# EasyEDA Pro project ProPrj_tachoConverter_2025-10-29.epro

# Schematic untitled
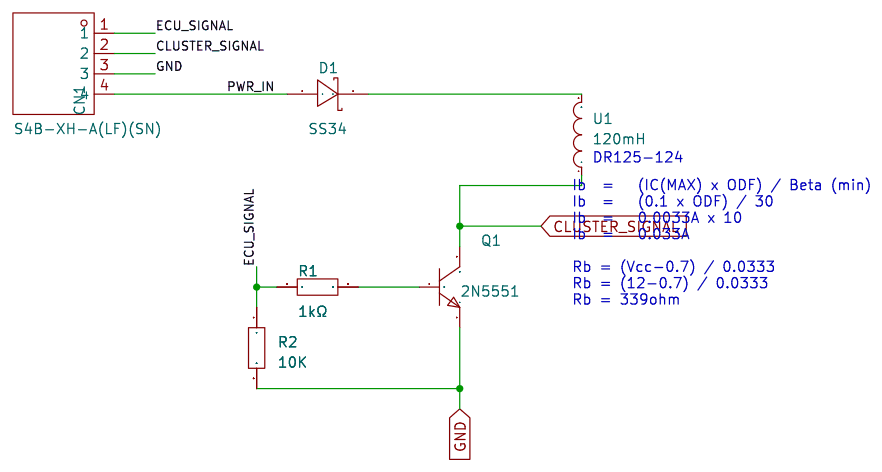
[diagram p0: schematic sheet]

## Parts
CN1  S4B-XH-A(LF)(SN)  [CONN-TH_S4B-XH-A-LF-SN]
D1  SS34  [SMA_L4.3-W2.6-LS5.2-RD]
Q1  2N5551  [SOT-23-3_L2.9-W1.4-P1.90-LS2.5-BR]
R1  1kΩ  [R0603]
R2  10K  [R0603]
U1  120mH  [IND-SMD_L12.5-W12.5]

## Library data of the parts
CN1 = S4B-XH-A(LF)(SN): Pins Structure:1x4P Pitch:2.5mm Mounting Style:Bend insert Reference Series:XH Number of Pins:4P Number of Rows:1 Number of PINs Per Row:4 Row Spacing:- Current Rating (Max):3A Contact Material:Brass Contact Plating:Tin Operating Temperature Range:-25℃~+8; LCSC Part Name: 1x4P 间距:2.5mm 弯插 系列:XH; Supplier Part: C157925; Manufacturer: JST; Supplier Footprint: 弯插,P=2.5mm; JLCPCB Part Class: Extended Part; Datasheet: https://atta.szlcsc.com/upload/public/pdf/source/20180928/C265283_F9DFEEBDB2CF642B6BDFAB4B77BD2680.pdf; Supplier: LCSC; Pins Structure: 1x4P; Pitch: 2.5mm; Mounting Style: Bend insert; Reference Series: XH; Number of Pins: 4P; Number of Rows: 1; Number of PINs Per Row: 4; Current Rating (Max): 3A; Contact Material: Brass; Contact Plating: Tin; Operating Temperature Range: -25℃~+85℃; Rated Voltage (Max): 250V; Plastic Material: PA66; Flame Retardant Rating: UL94V-0; Supplementary Features: K-leg punch; Colour: White; Z-Height of the Board: 6.1mm; X-Length of Bottom Edge on Board (Spacing Line): 12.4mm; Y-Width of Bottom Edge on Board: 11.5mm
D1 = SS34_C8678: Diode Configuration:Independent Type Forward Voltage (Vf@If):550mV@3A Reverse Voltage (Vr):40V Rectified Current:3A Reverse Leakage Current (Ir):500uA@40V; LCSC Part Name: 电压:40V 电流:3A; Supplier Part: C8678; Manufacturer: MDD(辰达半导体); Supplier Footprint: SMA(DO-214AC); JLCPCB Part Class: Basic Part; Datasheet: https://atta.szlcsc.com/upload/public/pdf/source/20240710/2118BB86FDDB2E0B294389AC1F3F65C8.pdf; Supplier: LCSC; Diode Configuration: Independent Type; Forward Voltage (Vf@If): 550mV@3A; Reverse Voltage (Vr): 40V; Rectified Current: 3A; Reverse Leakage Current (Ir): 500uA@40V
Q1 = 2N5551_C7529570: Transistor Type: Collector Current (Ic): Collector-Emitter Breakdown Voltage (Vceo): Power Dissipation (Pd):625mW DC Current Gain (hFE@Ic,Vce):80@10mA,5V DC Current Gain (hFE@Ic,Vce):80@10mA,5V Transition Frequency (fT):80MHz Collector Cut-Off Current (Ic; LCSC Part Name: NPN 电流:1A 耐压:160V; Supplier Part: C7529570; Manufacturer: RUILON(瑞隆源); Supplier Footprint: SOT-23; JLCPCB Part Class: Extended Part; Datasheet: https://atta.szlcsc.com/upload/public/pdf/source/20231206/D621ADD1802AEB70BE68282CC20D67DB.pdf; Supplier: LCSC; Power Dissipation (Pd): 625mW; DC Current Gain (hFE@Ic,Vce): 80@10mA,5V; Transition Frequency (fT): 80MHz; Collector Cut-Off Current (Icbo): 100nA; Collector-Emitter Saturation Voltage (VCE(sat)@Ic,Ib): 500mV@50mA,5mA; Operating Temperature: -55℃~+150℃
R1 = 0603WAF1001T5E: Type:Thick Film Resistors Resistance:1kΩ Tolerance:±1% Tolerance:±1% Power(Watts): Overload Voltage (Max): Temperature Coefficient:±100ppm/℃ Temperature Coefficient:±100ppm/℃ Operating Temperature Range:-55℃~+155℃ Operating Temperature Range:-55℃~+155℃; LCSC Part Name: 1kΩ ±1% 100mW 厚膜电阻; Supplier Part: C21190; Manufacturer: UNI-ROYAL(厚声); Supplier Footprint: 0603; JLCPCB Part Class: Basic Part; Datasheet: https://atta.szlcsc.com/upload/public/pdf/source/20200306/C422600_1E6D84923E4A46A82E41ADD87F860B5C.pdf; Supplier: LCSC; Type: Thick Film Resistors; Tolerance: ±1%; Temperature Coefficient: ±100ppm/℃; Operating Temperature Range: -55℃~+155℃
R2 = Res_0603: Supplier Footprint: 0603
U1 = DR125-124-R: Inductance:120mH Tolerance:±20% Tolerance:±20% Current Rating:60mA Current - Saturation(Isat):69mA DC Resistance(DCR):150Ω Type:- Ratings:-; LCSC Part Name: 120mH ±20% 69mA; Supplier Part: C2453120; Manufacturer: EATON(伊顿); Supplier Footprint: SMD,12.5x12.5mm; JLCPCB Part Class: Extended Part; Datasheet: https://atta.szlcsc.com/upload/public/pdf/source/20210417/1890D5F29C45E96B4D8E6D27BBAB5A55.pdf; Supplier: LCSC; Tolerance: ±20%; Current Rating: 60mA; Current - Saturation(Isat): 69mA; DC Resistance(DCR): 150Ω

## Nets
GND: CN1.3 Q1.2(E) R2.2
CLUSTER_SIGNAL: CN1.2 Q1.3(C) U1.1
ECU_SIGNAL: CN1.1 R1.1 R2.1
N$3: D1.1(K) U1.2
PWR_IN: CN1.4 D1.2(A)
$1N6: Q1.1(B) R1.2

## Notes on the sheet
- DR125-124
- Ib  =   (IC(MAX) x ODF) / Beta (min)
  Ib  =   (0.1 x ODF) / 30
  Ib  =   0.0033A x 10
  Ib  =   0.033A
  Rb = (Vcc-0.7) / 0.0333
  Rb = (12-0.7) / 0.0333
  Rb = 339ohm

# Board untitled
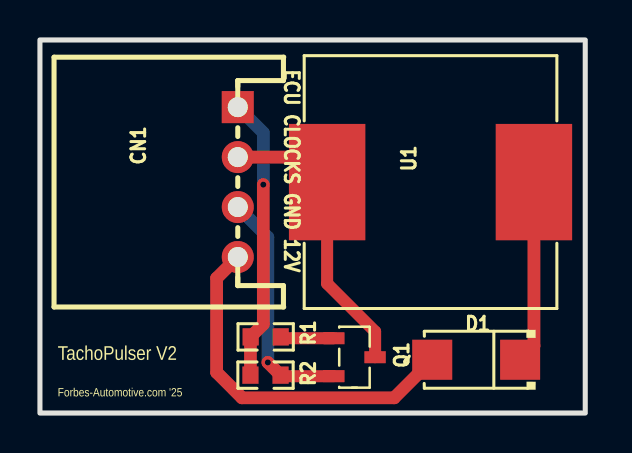
[diagram p1: board, top side]
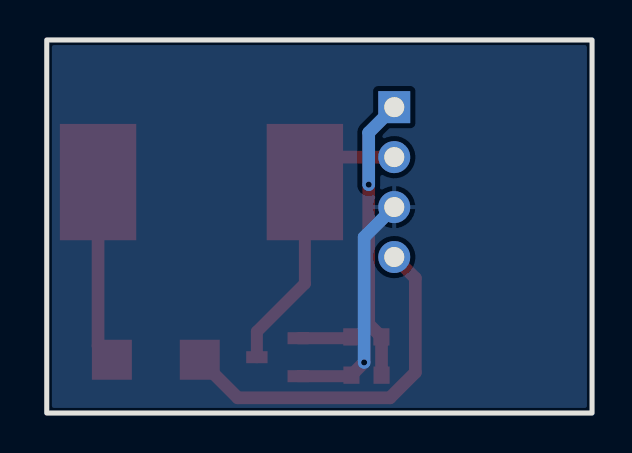
[diagram p2: board, bottom side, seen from below]

Outline 27.31 x 18.67 mm; copper layers: Top Layer, Bottom Layer. Coordinates in mm from the lower left corner of the outline.
Outline path: rectangle 0,18.67 27.31,0
Stack: Top Layer 0.035mm / Dielectric1 1.51mm FR4 er 4.5 / Bottom Layer 0.035mm

## Design rules (mm)
template: Custom Config
spacing copperThickness1oz (default): track to track 0.102, other pairs 0.152 to 0.3
spacing copperThickness2oz: track to track 0.203, other pairs 0.152 to 0.3
track width copperThickness1oz (default): min 0.457, default 0.635, max 2.54
track width copperThickness2oz: min 0.203, default 0.254, max 2.54
differential pair differentialPair (default): width min 0.127, default 0.254, max 2.54; gap min 0.152, default 0.152
via viaSize (default): diameter min 0.5, default 0.61, max 10; hole min 0.3, default 0.305, max 6.3

## Placement (name value [footprint] x y rotation side)
CN1  S4B-XH-A(LF)(SN)  [CONN-TH_S4B-XH-A-LF-SN]  9.91 11.56 90 top
D1  SS34  [SMA_L4.3-W2.6-LS5.2-RD]  21.84 2.67 180 top
Q1  2N5551  [SOT-23-3_L2.9-W1.4-P1.90-LS2.5-BR]  15.75 2.79 180 top
R1  1kΩ  [R0603]  11.3 3.81 0 top
R2  10K  [R0603]  11.29 1.9 0 top
U1  120mH  [IND-SMD_L12.5-W12.5]  19.56 11.56 180 top

## Footprints (pads in the part's own frame, mm; a bottom-side part is the same pattern mirrored in y, then rotated)
CONN-TH_S4B-XH-A-LF-SN
  rect 1.6x1.6 hole 1: 1(3.75,0)
  round 1.6 hole 1: 2(1.25,0) 3(-1.25,0) 4(-3.75,0)
IND-SMD_L12.5-W12.5
  rect 3.824x5.82 smd: 1(5.178,0) 2(-5.178,0)
R0603
  rect 0.806x0.864 smd: 1(-0.753,0) 2(0.753,0)
SMA_L4.3-W2.6-LS5.2-RD
  rect 2x2 smd: 1(-2.2,0) 2(2.2,0)
SOT-23-3_L2.9-W1.4-P1.90-LS2.5-BR
  rect 1.07x0.6 smd: 1(1.035,-0.95) 2(1.035,0.95) 3(-1.035,0)

## Nets
As in the schematic.

## Via types
v1: diameter 0.61, hole 0.305, Top Layer to Bottom Layer, 2 vias

## Routing (per net, layer and track width the routed paths; a pad name or vN(x,y) marks a point on that pad's centre or on a via; arc(x,y) is an arc through that point)
GND: length 12
  Top Layer w0.6: Q1.2 12.1,1.84 R2.2
  Top Layer w0.635: R2.2 v1(11.41,2.53)
  Bottom Layer w0.635: CN1.3 11.41,8.8 v1(11.41,2.53)
CLUSTER_SIGNAL: length 14.8
  Top Layer w0.6: U1.1 14.38,6.48 16.78,4.07 Q1.3
  Top Layer w0.635: CN1.2 13.13,12.81 U1.1
ECU_SIGNAL: length 14.2
  Top Layer w0.635: v1(11.18,11.43) 11.18,4.44 R1.1 10.54,3.8 R2.1
  Bottom Layer w0.635: CN1.1 11.18,14.03 v1(11.18,11.43)
N$3: length 9.2
  Top Layer w0.635: U1.2 24.74,3.36 D1.1
PWR_IN: length 18.3
  Top Layer w0.635: CN1.4 8.85,6.75 8.85,2.03 10.12,0.76 17.74,0.76 D1.2
$1N6: length 2.7
  Top Layer w0.6: R1.2 12.12,3.74 Q1.1

## Copper pours and planes (outline as drawn; the poured copper is in the pictures)
GND on Bottom Layer: 0,18.67 27.31,18.67 27.31,0 0,0

## Text on the board
Top Silkscreen Layer: ECU CLOCKS GND 12V | Forbes-Automotive.com '25 | TachoPulser V2
